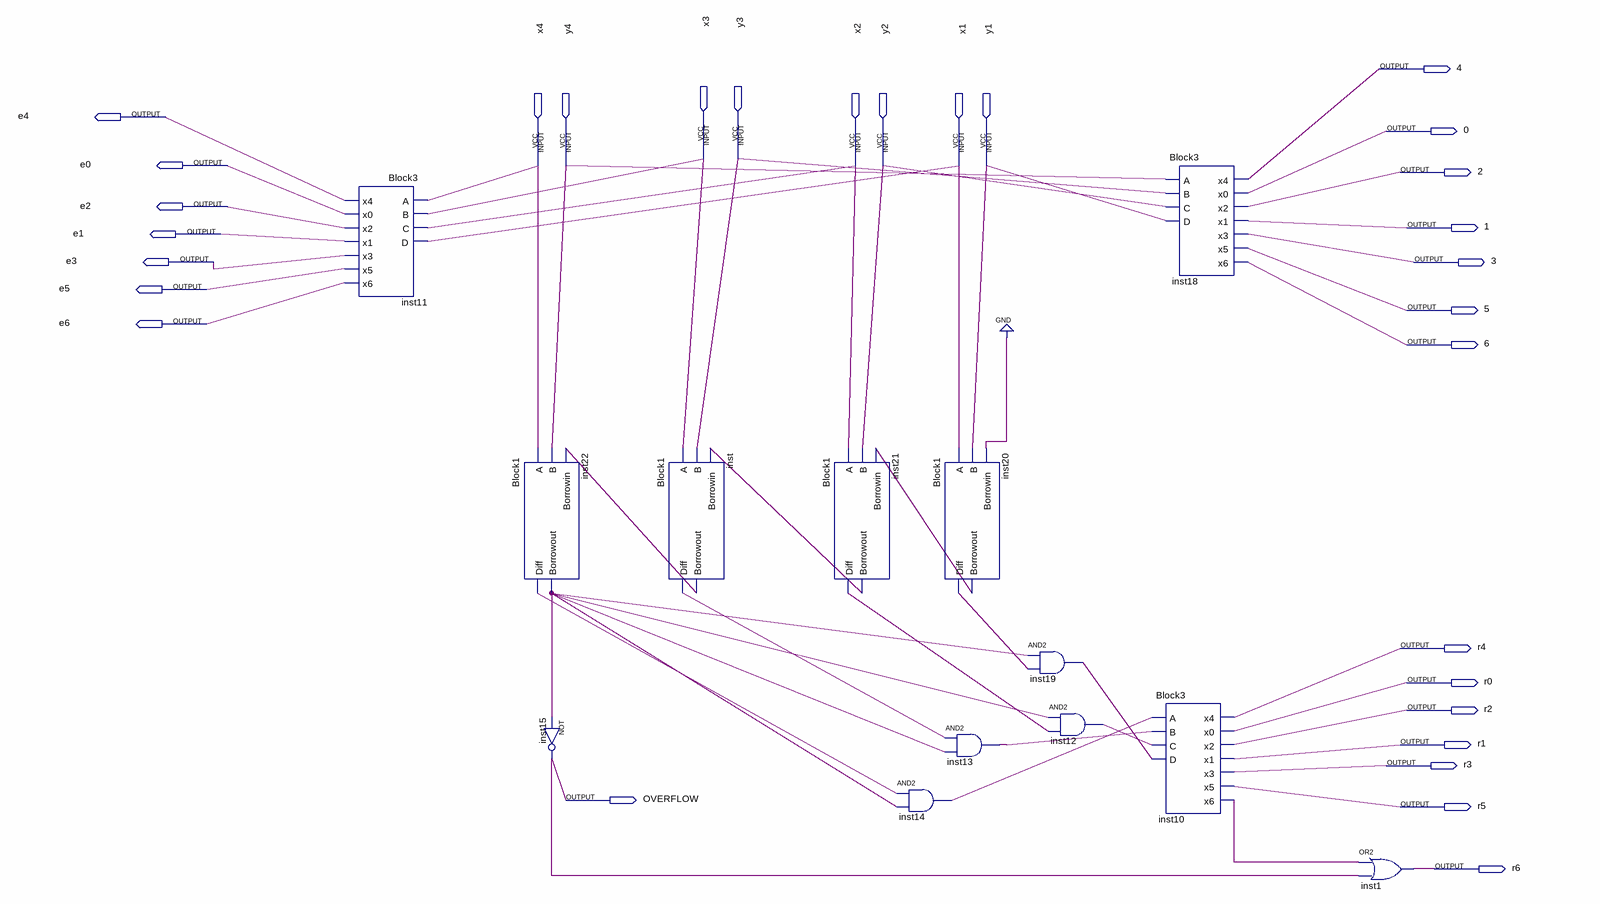
[diagram p0: schematic sheet]
// Quartus schematic Aula8.bdf as structural Verilog: 13 symbols, 30 pins
module Aula8 (
  input  x3,
  input  y3,
  input  x4,
  input  y4,
  input  x2,
  input  y2,
  input  x1,
  input  y1,
  output \4 ,
  output e4,
  output \0 ,
  output e0,
  output \2 ,
  output e2,
  output \1 ,
  output e1,
  output e3,
  output \3 ,
  output e5,
  output \5 ,
  output e6,
  output \6 ,
  output r4,
  output r0,
  output r2,
  output r1,
  output r3,
  output OVERFLOW,
  output r5,
  output r6
);

  wire inst10_x6, inst12_out, inst13_out, inst14_out, inst19_out, inst20_borrowout, inst20_diff,
       inst21_borrowout, inst21_diff, inst22_borrowout, inst22_diff, inst_borrowout, inst_diff;

  Block3 inst11 (.A(x4), .B(x3), .C(x2), .D(x1), .x4(e4), .x0(e0), .x2(e2), .x1(e1), .x3(e3), .x5(e5), .x6(e6));
  Block1 inst22 (.A(x4), .B(y4), .Borrowin(inst_borrowout), .Diff(inst22_diff), .Borrowout(inst22_borrowout));
  not inst15 (OVERFLOW, inst22_borrowout);
  Block1 inst (.A(x3), .B(y3), .Borrowin(inst21_borrowout), .Diff(inst_diff), .Borrowout(inst_borrowout));
  Block1 inst21 (.A(x2), .B(y2), .Borrowin(inst20_borrowout), .Diff(inst21_diff), .Borrowout(inst21_borrowout));
  and inst14 (inst14_out, inst22_diff, inst22_borrowout);
  Block1 inst20 (.A(x1), .B(y1), .Borrowin(1'b0), .Diff(inst20_diff), .Borrowout(inst20_borrowout));
  and inst13 (inst13_out, inst_diff, inst22_borrowout);
  and inst19 (inst19_out, inst22_borrowout, inst20_diff);
  and inst12 (inst12_out, inst22_borrowout, inst21_diff);
  Block3 inst18 (.A(y4), .B(y3), .C(y2), .D(y1), .x4(\4 ), .x0(\0 ), .x2(\2 ), .x1(\1 ), .x3(\3 ), .x5(\5 ), .x6(\6 ));
  Block3 inst10 (
    .A(inst14_out), .B(inst13_out), .C(inst12_out), .D(inst19_out), .x4(r4), .x0(r0), .x2(r2), .x1(r1),
    .x3(r3), .x5(r5), .x6(inst10_x6));
  or inst1 (r6, inst10_x6, OVERFLOW);
endmodule
